# EAGLE design LTC3108 Breakout (EAGLE 6.4)
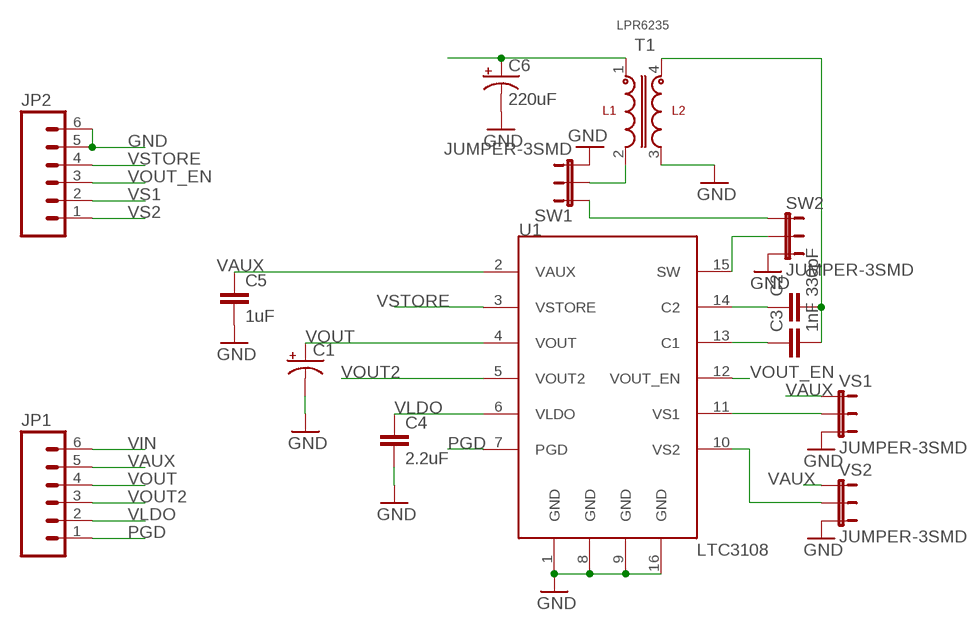
[diagram p0: schematic, sheet 1]

## Parts
C1  CAP_POL7343  [EIA7343]
C2  330pF  CAP0603-CAP  [0603-CAP]
C3  1nF  CAP0603-CAP  [0603-CAP]
C4  2.2uF  CAP0603-CAP  [0603-CAP]
C5  1uF  CAP0603-CAP  [0603-CAP]
C6  220uF  CAP_POL7343  [EIA7343]
JP1  M06SIP  [1X06]
JP2  M06SIP  [1X06]
SW1  JUMPER-3SMD  [SJ_3]
SW2  JUMPER-3SMD  [SJ_3]
T1  LPR6235  [LPR6235]
U1  LTC3108  [SSOP]
VS1  JUMPER-3SMD  [SJ_3]
VS2  JUMPER-3SMD  [SJ_3]

## Nets
GND: C1.C(-) C4.2 C5.2 C6.C(-) JP2.5 JP2.6 SW1.3 SW2.3 T1.3 U1.1(GND) U1.8(GND) U1.9(GND) U1.16(GND) VS1.3 VS2.3
N$1: C2.1 U1.14(C2)
N$2: C3.1 U1.13(C1)
N$3: C2.2 C3.2 T1.4
N$9: SW2.2 U1.15(SW)
N$12: SW1.1 SW2.1
N$13: SW1.2 T1.2
PGD: JP1.1 U1.7(PGD)
VAUX: C5.1 JP1.5 U1.2(VAUX) VS1.1 VS2.1
VIN: C6.A(+) JP1.6 T1.1
VLDO: C4.1 JP1.2 U1.6(VLDO)
VOUT: C1.A(+) JP1.4 U1.4(VOUT)
VOUT2: JP1.3 U1.5(VOUT2)
VOUT_EN: JP2.3 U1.12(VOUT_EN)
VS1: JP2.2 U1.11(VS1) VS1.2
VS2: JP2.1 U1.10(VS2) VS2.2
VSTORE: JP2.4 U1.3(VSTORE)

## Library data of the parts
C1 C6 = SparkFun-Passives:CAP_POL: Capacitor Polarized These are standard SMD and PTH capacitors. Normally 10uF, 47uF, and 100uF in electrolytic and tantalum varieties. Always verify the external diameter of the through hole cap, it varies with capacity, voltage, and manufacturer. The EIA devices should be standard.
C2-C5 = SparkFun-Passives:CAP: Capacitor Standard 0603 ceramic capacitor, and 0.1" leaded capacitor.
JP1 JP2 = SparkFun-Connectors:M06: Header 6 Standard 6-pin 0.1" header. Use with straight break away headers (SKU : PRT-00116), right angle break away headers (PRT-00553), swiss pins (PRT-00743), machine pins (PRT-00117), and female headers (PRT-00115). Molex polarized connector foot print use with SKU : PRT-08094 with associated crimp pins and housings. NOTES ON THE VARIANTS LOCK and LOCK_LONGPADS... This footprint was designed to help hold the alignment of a through-hole component (i.e. 6-pin header) while soldering it into place. You may notice that each hole has been shifted either up or down by 0.005 of an inch from it's more standard position (which is a perfectly straight line). This slight alteration caused the pins (the squares in the middle) to touch the edges of the holes. Because they are alternating, it causes a "brace" to hold the component in place. 0.005 has proven to be the perfect amount of "off-center" position when using our standard breakaway headers. Although looks a little odd when you look at the bare footprint, once you have a header in there, the alteration is very hard to notice. Also, if you push a header all the way into place, it is covered up entirely on the bottom side. This idea of altering the position of holes to aid alignment will be further integrated into the Sparkfun Library for other footprints. It can help hold any component with 3 or more connection pins.
SW1 SW2 VS1 VS2 = SparkFun-Passives:JUMPER-3
T1 = umich:LPR6235
U1 = LTC3108:LTC3108

## Board
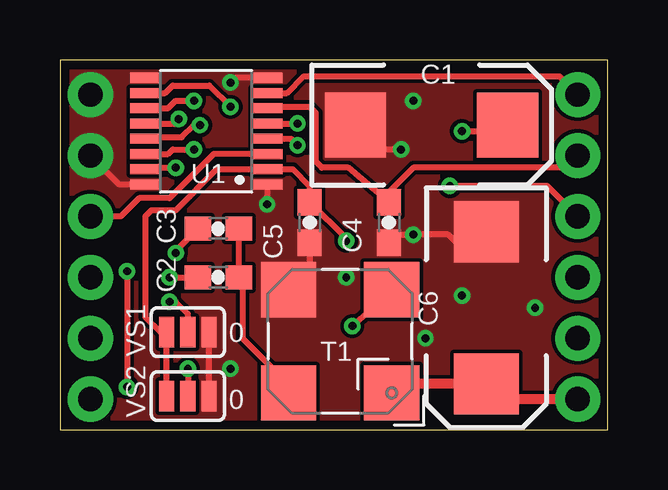
[diagram p1: board, top side]
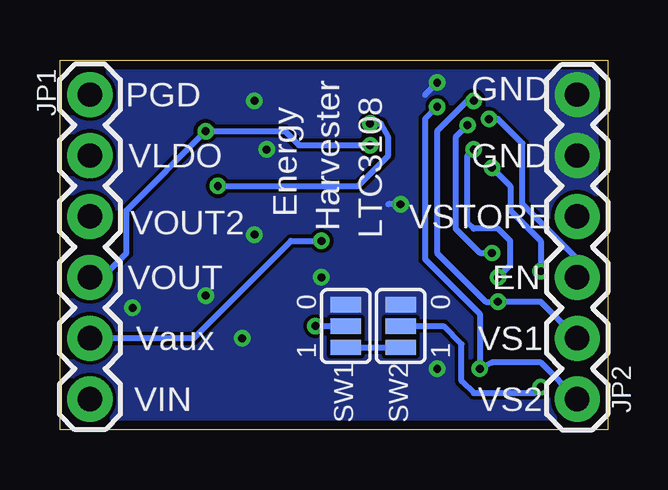
[diagram p2: board, bottom side, seen from below]

Size 22.84 x 15.42 mm. Coordinates in mm from the lower left corner, seen from the top.
Outline: 0,0 22.84,0 22.84,15.42 0,15.42 0,0
Copper layers (1*16): Top 0.0356mm / dielectric 1.5011mm / Bottom 0.0356mm
Design rules "LaenPCBOrder": minimum track width 6mil, minimum drill 13mil, track to track 6mil, track to pad 6mil, pad to pad 6mil, via to via 6mil, smd to smd 6mil, copper to edge 15mil, drill to drill 6mil, minimum pad ring 7mil, minimum via ring 7mil, stop-mask expansion 4mil, vias tented up to drill 13mil, thermal gap 10mil

### Footprints (pad centres in the part's own frame; a part is rotated, then mirrored left to right if it is on the bottom)
EIA7343 = smd 2.55 x 2.7: A 3.17,0; C -3.17,0
0603-CAP = smd 1.1 x 1: 1 -0.85,0; 2 0.85,0
1X06 = drill 1.016 pad 1.88: 1 0,0; 2 2.54,0; 3 5.08,0; 4 7.62,0; 5 10.16,0; 6 12.7,0
SJ_3 = smd 0.635 x 1.27: 1 -0.889,0; 2 0,0; 3 0.889,0
LPR6235 = smd 2.3 x 2.3: 1 -2.15,2.15; 2 -2.15,-2.15; 3 2.15,-2.15; 4 2.15,2.15
SSOP = smd 1.27 x 0.419: 1 -2.54,2.223; 2 -2.54,1.587; 3 -2.54,0.953; 4 -2.54,0.318; 5 -2.54,-0.318; 6 -2.54,-0.953; 7 -2.54,-1.587; 8 -2.54,-2.223; 9 2.54,-2.223; 10 2.54,-1.587; 11 2.54,-0.953; 12 2.54,-0.318; 13 2.54,0.318; 14 2.54,0.953; 15 2.54,1.587; 16 2.54,2.223

### Placement (x,y rotation side)
C1  15.49,12.7 0 top
C2  6.6,6.35 0 top
C3  6.6,8.38 0 top
C4  13.72,8.64 270 top
C5  10.41,8.64 270 top
C6  17.78,5.08 270 top
JP1  21.59,13.97 270 bottom
JP2  1.27,1.27 90 bottom
SW1  10.92,4.32 90 bottom
SW2  8.64,4.32 90 bottom
T1  11.68,3.68 180 top
U1  6.1,12.45 180 top
VS1  5.33,4.06 0 top
VS2  5.33,1.4 0 top

### Tracks (layer width: path | path; a pad name or v marks a point on that pad's centre or on a via)
GND  (via drill 0.33)
  Top 0.254: U1.1 v8.64,9.4 | VS2.3 VS1.3 | T1.3 9.26,5.71 9.91,6.35 10.41,6.35 C5.2 | U1.9 3.49,14.73 | 8.45,14.67 U1.8 7.3,14.67 v7.11,14.48 | 7.11,2.41 v7.11,2.54 | U1.16 2.48,10.22 JP2.5 | C1.C 12.45,12.7 13.46,11.68 v14.22,11.68 | C6.C 17.39,8.64 16.54,7.79 16.2,8.13 v14.73,8.13 13.8,8.13 C4.2
  Bottom 0.254: v8.64,9.4 9.14,9.4 | 10.54,5.21 SW1.3 | v7.11,14.48 7.62,13.97
  other vias: 11.94,6.35 19.81,5.08 16.76,5.59 15.24,3.81 14.73,13.72
  pour Bottom (no thermals): 0,0 0,15.49 23.11,15.49 23.11,0
  pour Top (no thermals): 0,0 0,15.49 23.11,15.49 23.11,0
N$1  (via drill 0.33)
  Top 0.254: U1.14 4.51,11.49 4.7,11.68 v5.59,11.68 | v4.57,6.35 C2.1
  Bottom 0.254: v4.57,6.35 4.06,6.86 4.06,7.87 4.57,8.38 5.59,8.38 5.84,8.64 5.84,11.43 v5.59,11.68
N$2  (via drill 0.33)
  Top 0.254: 5.84,8.47 C3.1 4.83,7.45 v4.83,7.37 | U1.13 3.62,12.19 5.08,12.19 5.59,12.7 v5.84,12.7
  Bottom 0.254: v5.84,12.7 6.35,12.19 6.35,8.38 5.33,7.37 v4.83,7.37
N$3
  Top 0.254: C3.2 C2.2 7.62,6.18 7.62,3.81 9.53,1.9 T1.4
N$9  (via drill 0.33)
  Top 0.254: U1.15 3.62,10.92 v4.83,10.92 | v2.79,6.6 v2.79,1.78
  Bottom 0.254: SW2.2 6.86,4.32 6.1,3.56 6.1,2.03 5.59,1.52 3.05,1.52 v2.79,1.78 | v4.83,10.92 4.06,10.16 4.06,9.14 2.79,7.87 v2.79,6.6
N$12
  Bottom 0.254: SW1.1 SW2.1
N$13  (via drill 0.33)
  Top 0.254: T1.2 v12.19,4.32
  Bottom 0.254: v12.19,4.32 SW1.2
PGD
  Top 0.254: U1.7 9.46,14.03 10.16,14.73 20.83,14.73 JP1.1
VAUX  (via drill 0.33)
  Top 0.254: VS2.1 VS1.1 4.19,4.06 3.56,4.7 3.56,8.89 3.81,9.14 4.83,9.14 6.54,10.86 U1.2 9.72,10.86 10.41,10.16 C5.1 11.94,7.96 v11.94,7.87
  Bottom 0.254: JP1.5 17.27,3.81 13.21,7.87 v11.94,7.87
VIN
  Top 0.254: 13.46,1.27 T1.1
  Top 0.406: JP1.6 18.42,1.27 C6.A 14.21,1.91 T1.1
VLDO
  Top 0.254: U1.6 8.7,13.46 10.41,13.46 10.67,13.21 10.67,11.18 10.92,10.92 12.03,10.92 C4.1 13.46,9.65 14.73,10.92 21.08,10.92 JP1.2
VOUT  (via drill 0.33)
  Top 0.254: v16.76,12.45 18.41,12.45 C1.A | U1.4 9.64,12.13 v9.91,11.86
  Bottom 0.254: JP1.4 21.08,6.35 20.07,7.37 20.07,9.14 v16.76,12.45 13.46,12.45 12.88,11.86 v9.91,11.86
VOUT2  (via drill 0.33)
  Top 0.254: JP1.3 20.32,10.16 v16.26,10.16 | U1.5 v9.91,12.76
  Bottom 0.254: v16.26,10.16 10.41,10.16 9.14,11.43 9.14,12.19 9.46,12.76 v9.91,12.76
VOUT_EN  (via drill 0.33)
  Top 0.254: U1.12 4.89,12.76 v4.95,12.95
  Bottom 0.254: v4.95,12.95 4.57,12.95 3.56,11.94 3.56,9.4 1.27,7.11 JP2.3
VS1  (via drill 0.33)
  Top 0.254: U1.11 4.51,13.4 4.83,13.72 v5.59,13.72 | VS1.2 5.33,4.83 4.83,5.33 v4.57,5.33
  Bottom 0.254: JP2.2 2.79,5.33 v4.57,5.33 5.08,5.33 7.11,7.37 7.11,12.45 5.84,13.72 v5.59,13.72
VS2  (via drill 0.33)
  Top 0.254: v5.33,2.54 VS2.2 | U1.10 4.38,14.03 4.7,14.35 6.22,14.35 v7.11,13.46
  Bottom 0.254: JP2.1 2.79,2.79 4.83,2.79 v5.33,2.54 5.33,4.83 7.62,7.11 7.62,12.95 v7.11,13.46
VSTORE
  Top 0.254: JP2.4 2.54,8.89 3.3,9.65 4.57,9.65 6.41,11.49 U1.3

### Text on the board
tPlace: 0 | 0
bPlace: GND | PGD | GND | LTC3108 | Harvester | Energy | VLDO | VSTORE | VOUT2 | EN | VOUT | 0 | 0 | VS1 | Vaux | 1 | 1 | VS2 | VIN